# Altium project LQ_extend_AD.PrjPcb
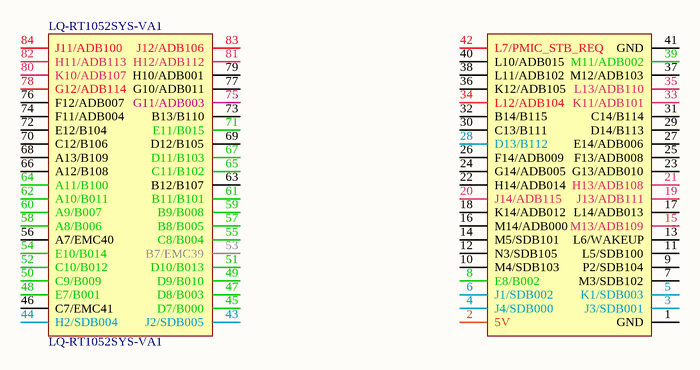
[diagram p0: LQ_extend.SchDoc]
1 sheet, 1 parts. Net scope: global (net labels, ports and power ports of the same name join across sheets).
Board file: LQ_extend.PcbDoc

## Sheet LQ_extend.SchDoc
size A4; SheetNumber: 1; SheetTotal: 1

### Parts
LQ-RT1052SYS-VA1  LQ-RT1052SYS-VA1  [LQ-RT1052SYS-VA1]

### Nets

Not connected (* = marked no-connect by the designer): LQ-RT1052SYS-VA1 1(GND) 2(5V) 3(J3/SDB001) 4(J4/SDB000) 5(K1/SDB003) 6(J1/SDB002) 7(M3/SDB102) 8(E8/B002) 9(P2/SDB104) 10(M4/SDB103) 11(L5/SDB100) 12(N3/SDB105) 13(L6/WAKEUP) 14(M5/SDB101) 15(M13/ADB109) 16(M14/ADB000) 17(L14/ADB013) 18(K14/ADB012) 19(J13/ADB111) 20(J14/ADB115) 21(H13/ADB108) 22(H14/ADB014) 23(G13/ADB010) 24(G14/ADB005) 25(F13/ADB008) 26(F14/ADB009) 27(E14/ADB006) 28(D13/B112) 29(D14/B113) 30(C13/B111) 31(C14/B114) 32(B14/B115) 33(K11/ADB101) 34(L12/ADB104) 35(L13/ADB110) 36(K12/ADB105) 37(M12/ADB103) 38(L11/ADB102) 39(M11/ADB002) 40(L10/ADB015) 41(GND) 42(L7/PMIC_STB_REQ) 43(J2/SDB005) 44(H2/SDB004) 45(D7/B000) 46(C7/EMC41) 47(D8/B003) 48(E7/B001) 49(D9/B010) 50(C9/B009) 51(D10/B013) 52(C10/B012) 53(B7/EMC39) 54(E10/B014) 55(C8/B004) 56(A7/EMC40) 57(B8/B005) 58(A8/B006) 59(B9/B008) 60(A9/B007) 61(B11/B101) 62(A10/B011) 63(B12/B107) 64(A11/B100) 65(C11/B102) 66(A12/B108) 67(D11/B103) 68(A13/B109) 69(D12/B105) 70(C12/B106) 71(E11/B015) 72(E12/B104) 73(B13/B110) 74(F11/ADB004) 75(G11/ADB003) 76(F12/ADB007) 77(G10/ADB011) 78(G12/ADB114) 79(H10/ADB001) 80(K10/ADB107) 81(H12/ADB112) 82(H11/ADB113) 83(J12/ADB106) 84(J11/ADB100)